# EAGLE schematic Motherboard (EAGLE 6.2)

## Sheet 1 of 5: Main Processor
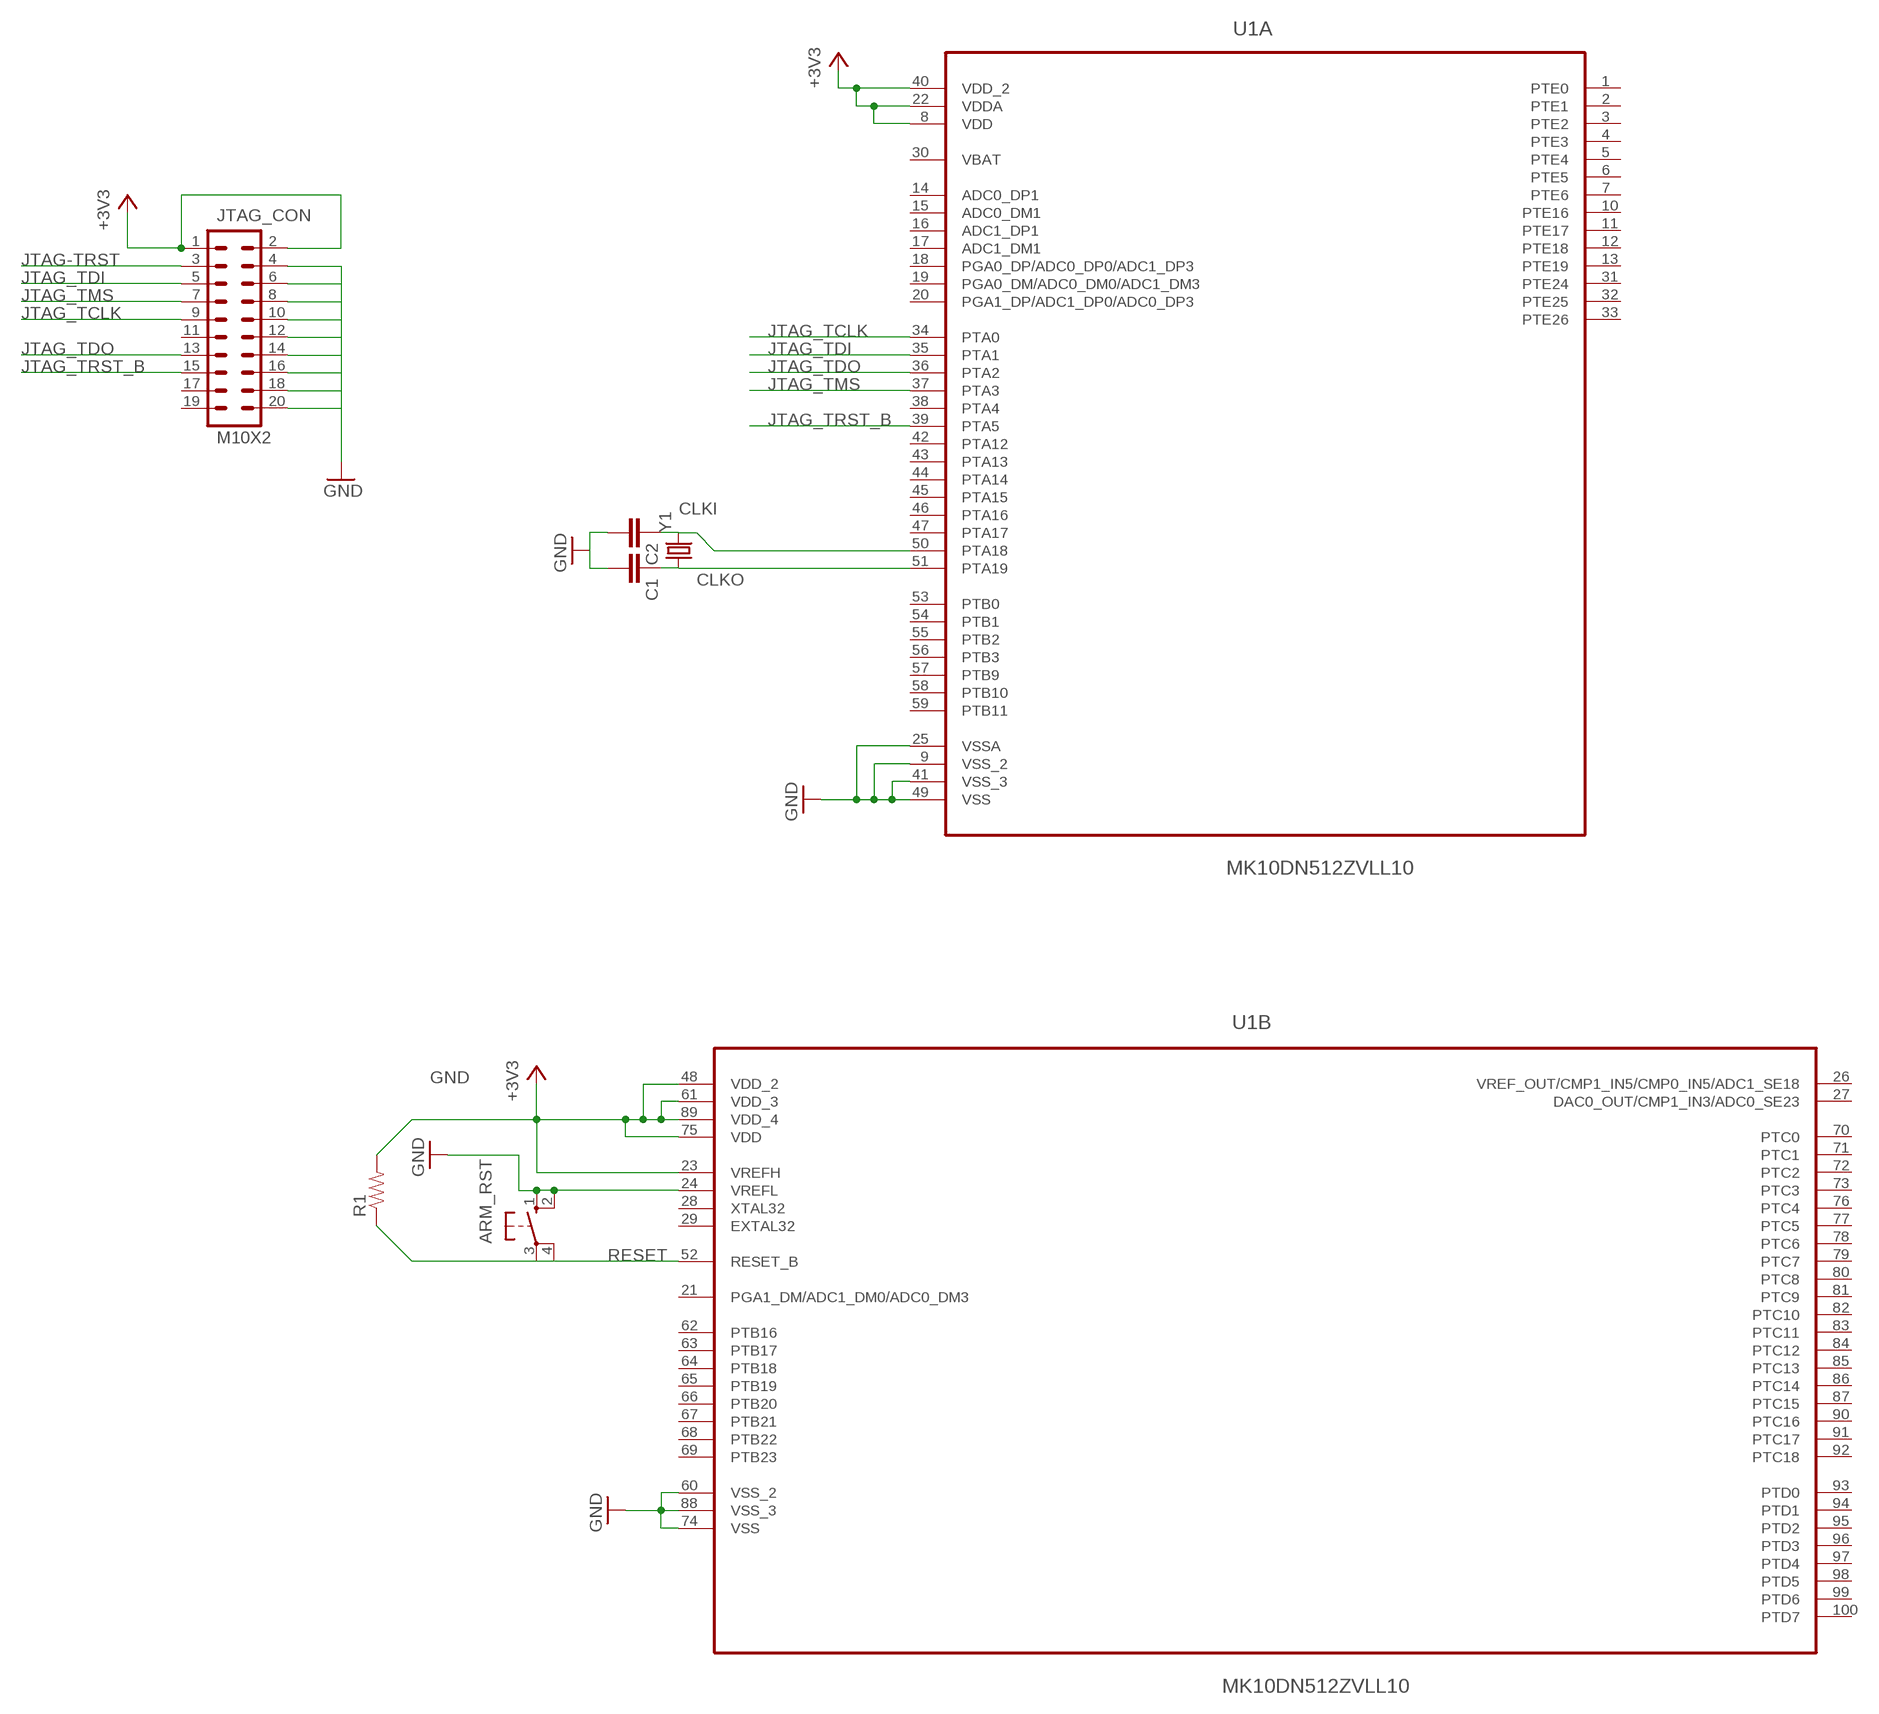
[diagram p0: schematic, sheet 1]

### Parts
ARM_RST  10-XX  [B3F-10XX]
C1  CAPPTH1  [CAP-PTH-5MM]
C2  CAPPTH1  [CAP-PTH-5MM]
JTAG_CON  M10X2  [2X10]
R1  RESISTORPTH-1/4W  [AXIAL-0.4]
U1  MK10DN512ZVLL10  [QFP50P1600X1600X170-100N]
Y1  CRYSTALHC49US  [HC49US]

### Nets
+3V3: JTAG_CON.1 JTAG_CON.2 R1.P$2 U1.8(A:VDD) U1.22(A:VDDA) U1.23(B:VREFH) U1.40(A:VDD_2) U1.48(B:VDD_2) U1.61(B:VDD_3) U1.75(B:VDD) U1.89(B:VDD_4)
CLKI: C2.1 U1.50(A:PTA18) Y1.2
CLKO: C1.1 U1.51(A:PTA19) Y1.1
GND: ARM_RST.1(S) ARM_RST.2(S1) C1.2 C2.2 JTAG_CON.4 JTAG_CON.6 JTAG_CON.8 JTAG_CON.10 JTAG_CON.12 JTAG_CON.14 JTAG_CON.16 JTAG_CON.18 JTAG_CON.20 U1.9(A:VSS_2) U1.24(B:VREFL) U1.25(A:VSSA) U1.41(A:VSS_3) U1.49(A:VSS) U1.60(B:VSS_2) U1.74(B:VSS) U1.88(B:VSS_3) ; also sheet 2,4
JTAG-TRST: JTAG_CON.3
JTAG_TCLK: JTAG_CON.9 U1.34(A:PTA0)
JTAG_TDI: JTAG_CON.5 U1.35(A:PTA1)
JTAG_TDO: JTAG_CON.13 U1.36(A:PTA2)
JTAG_TMS: JTAG_CON.7 U1.37(A:PTA3)
JTAG_TRST_B: JTAG_CON.15 U1.39(A:PTA5)
RESET: ARM_RST.3(P) ARM_RST.4(P1) R1.P$1 U1.52(B:RESET_B)
Unconnected: JTAG_CON.11 JTAG_CON.17 JTAG_CON.19 U1.1(A:PTE0) U1.2(A:PTE1) U1.3(A:PTE2) U1.4(A:PTE3) U1.5(A:PTE4) U1.6(A:PTE5) U1.7(A:PTE6) U1.10(A:PTE16) U1.11(A:PTE17) U1.12(A:PTE18) U1.13(A:PTE19) U1.14(A:ADC0_DP1) U1.15(A:ADC0_DM1) U1.16(A:ADC1_DP1) U1.17(A:ADC1_DM1) U1.18(A:PGA0_DP/ADC0_DP0/ADC1_DP3) U1.19(A:PGA0_DM/ADC0_DM0/ADC1_DM3) U1.20(A:PGA1_DP/ADC1_DP0/ADC0_DP3) U1.21(B:PGA1_DM/ADC1_DM0/ADC0_DM3) U1.26(B:VREF_OUT/CMP1_IN5/CMP0_IN5/ADC1_SE18) U1.27(B:DAC0_OUT/CMP1_IN3/ADC0_SE23) U1.28(B:XTAL32) U1.29(B:EXTAL32) U1.31(A:PTE24) U1.32(A:PTE25) U1.33(A:PTE26) U1.38(A:PTA4) U1.42(A:PTA12) U1.43(A:PTA13) U1.44(A:PTA14) U1.45(A:PTA15) U1.46(A:PTA16) U1.47(A:PTA17) U1.53(A:PTB0) U1.54(A:PTB1) U1.55(A:PTB2) U1.56(A:PTB3) U1.57(A:PTB9) U1.58(A:PTB10) U1.59(A:PTB11) U1.62(B:PTB16) U1.63(B:PTB17) U1.64(B:PTB18) U1.65(B:PTB19) U1.66(B:PTB20) U1.67(B:PTB21) U1.68(B:PTB22) U1.69(B:PTB23) U1.70(B:PTC0) U1.71(B:PTC1) U1.72(B:PTC2) U1.73(B:PTC3) U1.76(B:PTC4) U1.77(B:PTC5) U1.78(B:PTC6) U1.79(B:PTC7) U1.80(B:PTC8) U1.81(B:PTC9) U1.82(B:PTC10) U1.83(B:PTC11) U1.84(B:PTC12) U1.85(B:PTC13) U1.86(B:PTC14) U1.87(B:PTC15) U1.90(B:PTC16) U1.91(B:PTC17) U1.92(B:PTC18) U1.93(B:PTD0) U1.94(B:PTD1) U1.95(B:PTD2) U1.96(B:PTD3) U1.97(B:PTD4) U1.98(B:PTD5) U1.99(B:PTD6) U1.100(B:PTD7)

## Sheet 2 of 5: RS-485 External
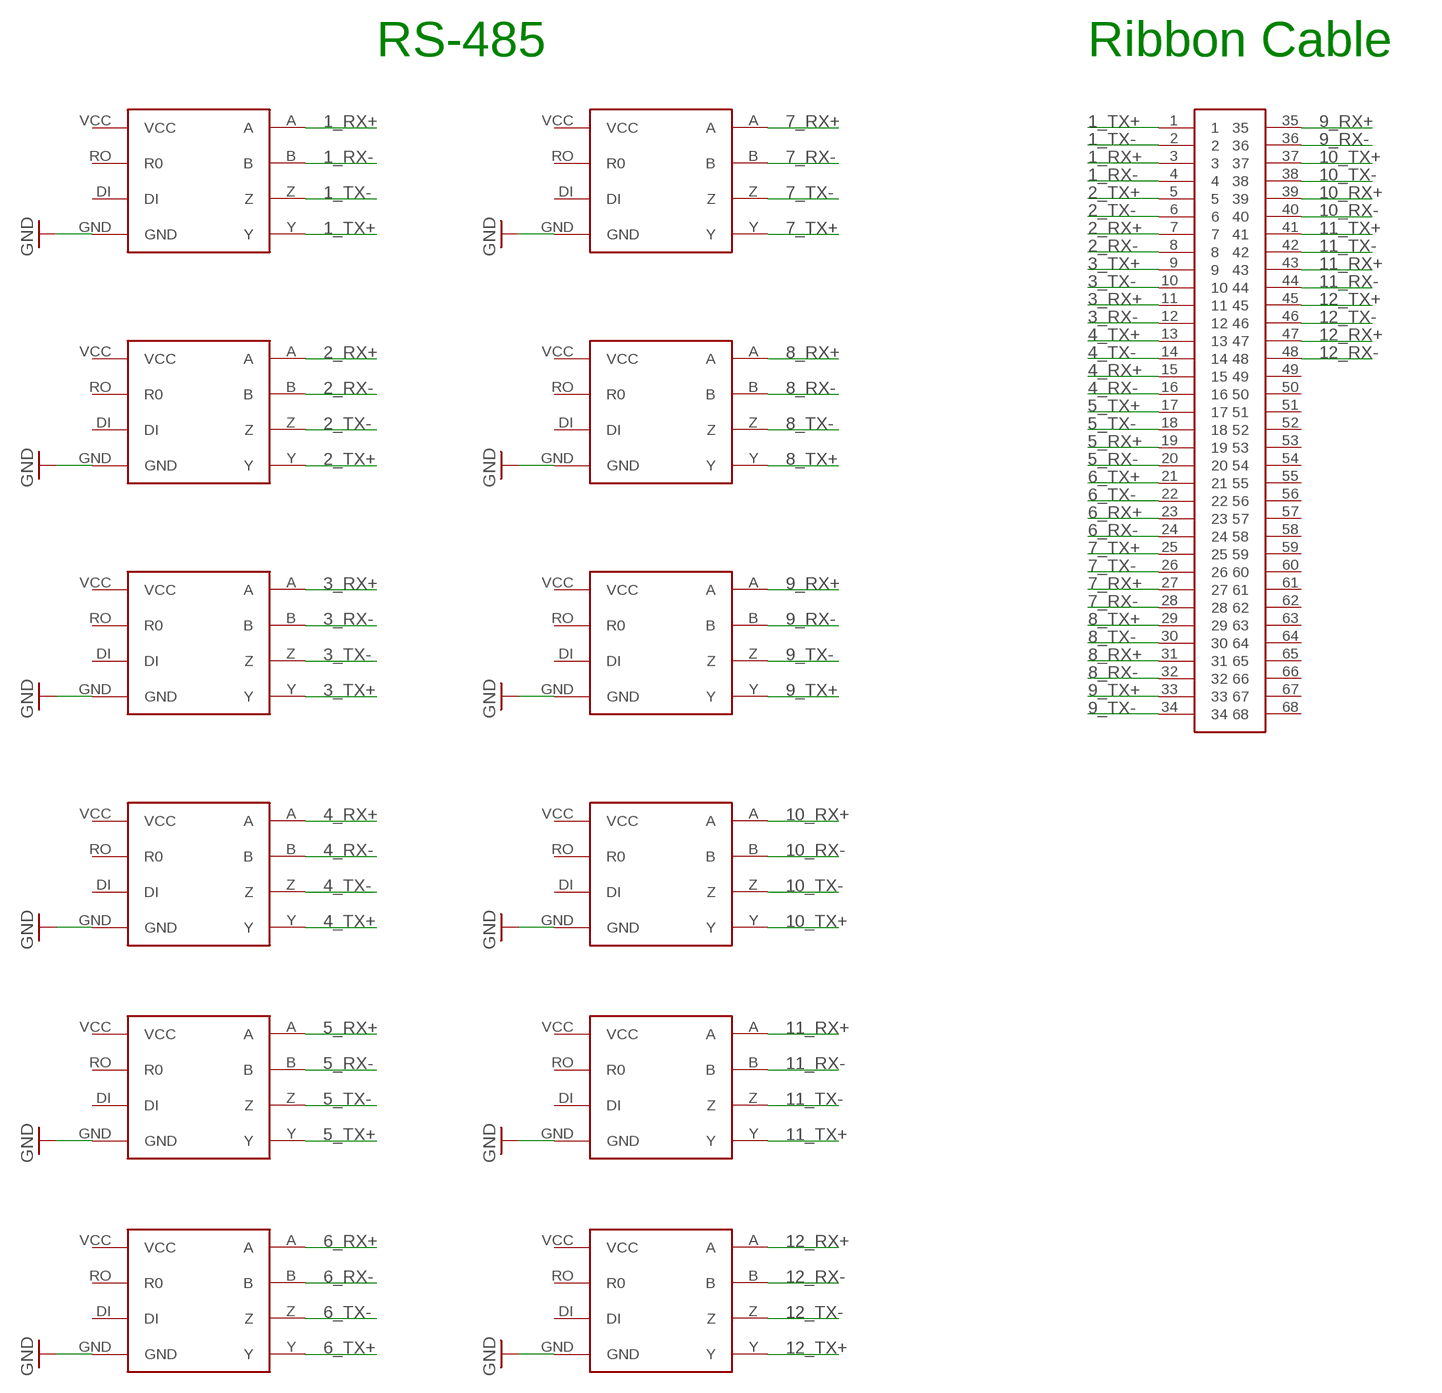
[diagram p1: schematic, sheet 2]

### Parts
U$4  MAX3077  [MAX3070E]
U$25  MAX3077  [MAX3070E]
U$26  MAX3077  [MAX3070E]
U$27  MAX3077  [MAX3070E]
U$28  MAX3077  [MAX3070E]
U$29  MAX3077  [MAX3070E]
U$30  MAX3077  [MAX3070E]
U$31  MAX3077  [MAX3070E]
U$32  MAX3077  [MAX3070E]
U$33  MAX3077  [MAX3070E]
U$34  MAX3077  [MAX3070E]
U$35  MAX3077  [MAX3070E]
U$36  TB60050685100  [60050685100]

### Nets
1_RX+: U$29.A U$36.3
1_RX-: U$29.B U$36.4
1_TX+: U$29.Y U$36.1
1_TX-: U$29.Z U$36.2
2_RX+: U$31.A U$36.7
2_RX-: U$31.B U$36.8
2_TX+: U$31.Y U$36.5
2_TX-: U$31.Z U$36.6
3_RX+: U$32.A U$36.11
3_RX-: U$32.B U$36.12
3_TX+: U$32.Y U$36.9
3_TX-: U$32.Z U$36.10
4_RX+: U$33.A U$36.15
4_RX-: U$33.B U$36.16
4_TX+: U$33.Y U$36.13
4_TX-: U$33.Z U$36.14
5_RX+: U$34.A U$36.19
5_RX-: U$34.B U$36.20
5_TX+: U$34.Y U$36.17
5_TX-: U$34.Z U$36.18
6_RX+: U$35.A U$36.23
6_RX-: U$35.B U$36.24
6_TX+: U$35.Y U$36.21
6_TX-: U$35.Z U$36.22
7_RX+: U$30.A U$36.27
7_RX-: U$30.B U$36.28
7_TX+: U$30.Y U$36.25
7_TX-: U$30.Z U$36.26
8_RX+: U$28.A U$36.31
8_RX-: U$28.B U$36.32
8_TX+: U$28.Y U$36.29
8_TX-: U$28.Z U$36.30
9_RX+: U$27.A U$36.35
9_RX-: U$27.B U$36.36
9_TX+: U$27.Y U$36.33
9_TX-: U$27.Z U$36.34
10_RX+: U$26.A U$36.39
10_RX-: U$26.B U$36.40
10_TX+: U$26.Y U$36.37
10_TX-: U$26.Z U$36.38
11_RX+: U$25.A U$36.43
11_RX-: U$25.B U$36.44
11_TX+: U$25.Y U$36.41
11_TX-: U$25.Z U$36.42
12_RX+: U$4.A U$36.47
12_RX-: U$4.B U$36.48
12_TX+: U$4.Y U$36.45
12_TX-: U$4.Z U$36.46
GND: U$4.GND U$25.GND U$26.GND U$27.GND U$28.GND U$29.GND U$30.GND U$31.GND U$32.GND U$33.GND U$34.GND U$35.GND ; also sheet 1,4
Unconnected: U$4.DI U$4.RO(R0) U$4.VCC U$25.DI U$25.RO(R0) U$25.VCC U$26.DI U$26.RO(R0) U$26.VCC U$27.DI U$27.RO(R0) U$27.VCC U$28.DI U$28.RO(R0) U$28.VCC U$29.DI U$29.RO(R0) U$29.VCC U$30.DI U$30.RO(R0) U$30.VCC U$31.DI U$31.RO(R0) U$31.VCC U$32.DI U$32.RO(R0) U$32.VCC U$33.DI U$33.RO(R0) U$33.VCC U$34.DI U$34.RO(R0) U$34.VCC U$35.DI U$35.RO(R0) U$35.VCC U$36.49 U$36.50 U$36.51 U$36.52 U$36.53 U$36.54 U$36.55 U$36.56 U$36.57 U$36.58 U$36.59 U$36.60 U$36.61 U$36.62 U$36.63 U$36.64 U$36.65 U$36.66 U$36.67 U$36.68

### Notes on the sheet
- RS-485 | Ribbon Cable

## Sheet 3 of 5: RS-485 Internal
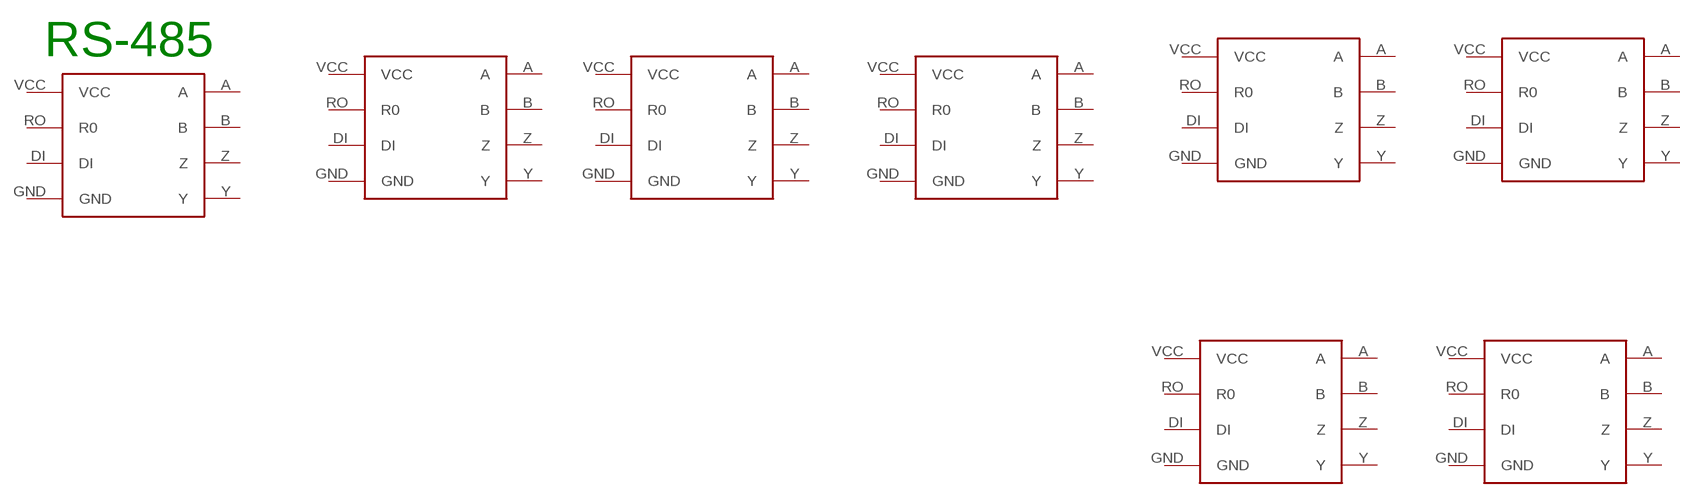
[diagram p2: schematic, sheet 3]

### Parts
U$3  MAX3077  [MAX3070E]
U$5  MAX3077  [MAX3070E]
U$6  MAX3077  [MAX3070E]
U$7  MAX3077  [MAX3070E]
U$8  MAX3077  [MAX3070E]
U$9  MAX3077  [MAX3070E]
U$10  MAX3077  [MAX3070E]
U$11  MAX3077  [MAX3070E]
Unconnected: U$3.A U$3.B U$3.DI U$3.GND U$3.RO(R0) U$3.VCC U$3.Y U$3.Z U$5.A U$5.B U$5.DI U$5.GND U$5.RO(R0) U$5.VCC U$5.Y U$5.Z U$6.A U$6.B U$6.DI U$6.GND U$6.RO(R0) U$6.VCC U$6.Y U$6.Z U$7.A U$7.B U$7.DI U$7.GND U$7.RO(R0) U$7.VCC U$7.Y U$7.Z U$8.A U$8.B U$8.DI U$8.GND U$8.RO(R0) U$8.VCC U$8.Y U$8.Z U$9.A U$9.B U$9.DI U$9.GND U$9.RO(R0) U$9.VCC U$9.Y U$9.Z U$10.A U$10.B U$10.DI U$10.GND U$10.RO(R0) U$10.VCC U$10.Y U$10.Z U$11.A U$11.B U$11.DI U$11.GND U$11.RO(R0) U$11.VCC U$11.Y U$11.Z

### Notes on the sheet
- RS-485

## Sheet 4 of 5: Sensors
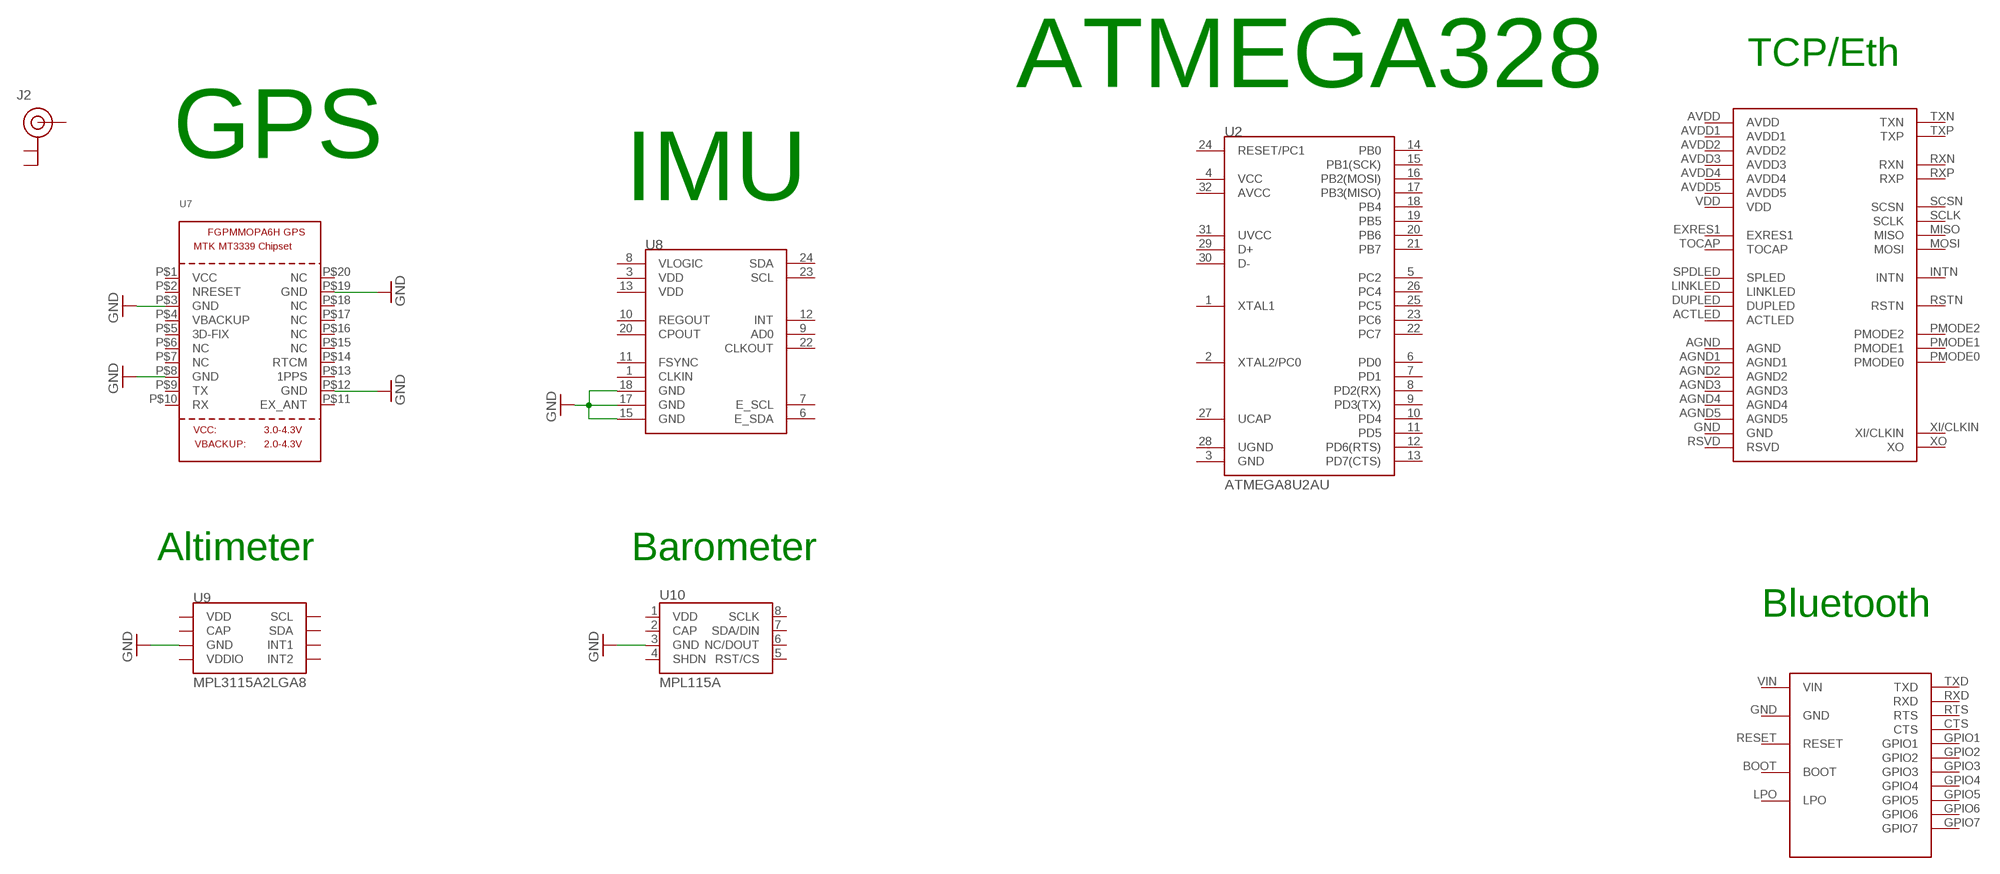
[diagram p3: schematic, sheet 4]

### Parts
J2  U.FL  [U.FL]
U2  ATMEGA8U2AU  [TQFP32-08]
U7  GPS_FGPMMOPA6H  [FGPMMOPA6H]
U8  MPU-9150QFN-24-NP  [QFN-24-NP]
U9  MPL3115A2LGA8  [LGA8]
U10  MPL115A  [LGA8]
U$12  W5500  [W5500]
U$13  SPBT2632C2A  [SPBT2632C2A]

### Nets
GND: U7.P$3(GND) U7.P$8(GND) U7.P$12(GND) U7.P$19(GND) U8.15(GND) U8.17(GND) U8.18(GND) U9.3(GND) U10.3(GND) ; also sheet 1,2
Unconnected: J2.P$1(GND) J2.P$2(GND) J2.P$3(SIGNAL) U2.1(XTAL1) U2.2(XTAL2/PC0) U2.3(GND) U2.4(VCC) U2.5(PC2) U2.6(PD0) U2.7(PD1) U2.8(PD2(RX)) U2.9(PD3(TX)) U2.10(PD4) U2.11(PD5) U2.12(PD6(RTS)) U2.13(PD7(CTS)) U2.14(PB0) U2.15(PB1(SCK)) U2.16(PB2(MOSI)) U2.17(PB3(MISO)) U2.18(PB4) U2.19(PB5) U2.20(PB6) U2.21(PB7) U2.22(PC7) U2.23(PC6) U2.24(RESET/PC1) U2.25(PC5) U2.26(PC4) U2.27(UCAP) U2.28(UGND) U2.29(D+) U2.30(D-) U2.31(UVCC) U2.32(AVCC) U7.P$1(VCC) U7.P$2(NRESET) U7.P$4(VBACKUP) U7.P$5(3D-FIX) U7.P$6(NC) U7.P$7(NC) U7.P$9(TX) U7.P$10(RX) U7.P$11(EX_ANT) U7.P$13(1PPS) U7.P$14(RTCM) U7.P$15(NC) U7.P$16(NC) U7.P$17(NC) U7.P$18(NC) U7.P$20(NC) U8.1(CLKIN) U8.3(VDD) U8.6(E_SDA) U8.7(E_SCL) U8.8(VLOGIC) U8.9(AD0) U8.10(REGOUT) U8.11(FSYNC) U8.12(INT) U8.13(VDD) U8.20(CPOUT) U8.22(CLKOUT) U8.23(SCL) U8.24(SDA) U9.5(INT2) U9.6(INT1) U9.7(SDA) U9.8(SCL) U10.1(VDD) U10.2(CAP) U10.4(SHDN) U10.5(RST/CS) U10.6(NC/DOUT) U10.7(SDA/DIN) U10.8(SCLK) U$12.ACTLED U$12.AGND U$12.AGND1 U$12.AGND2 U$12.AGND3 U$12.AGND4 U$12.AGND5 U$12.AVDD U$12.AVDD1 U$12.AVDD2 U$12.AVDD3 U$12.AVDD4 U$12.AVDD5 U$12.DUPLED U$12.EXRES1 U$12.GND U$12.INTN U$12.LINKLED U$12.MISO U$12.MOSI U$12.PMODE0 U$12.PMODE1 U$12.PMODE2 U$12.RSTN U$12.RSVD U$12.RXN U$12.RXP U$12.SCLK U$12.SCSN U$12.SPDLED(SPLED) U$12.TOCAP U$12.TXN U$12.TXP U$12.VDD U$12.XI/CLKIN U$12.XO U$13.BOOT U$13.CTS U$13.GND U$13.GPIO1 U$13.GPIO2 U$13.GPIO3 U$13.GPIO4 U$13.GPIO5 U$13.GPIO6 U$13.GPIO7 U$13.LPO U$13.RESET U$13.RTS U$13.RXD U$13.TXD U$13.VIN

### Notes on the sheet
- ATMEGA328
- TCP/Eth
- GPS
- IMU
- Altimeter
- Barometer
- Bluetooth

## Sheet 5 of 5: Power

## Power pins joined to a net without a drawn wire
CAP: U9.2(CAP)
VBAT: U1.30(A:VBAT)
VDD: U9.1(VDD)
VDDIO: U9.4(VDDIO)

## Library data of the parts
ARM_RST = switch-omron:10-XX: OMRON SWITCH; MPN: B3F-1000; OC_FARNELL: 176432; OC_NEWARK: 36M3542
C1 C2 = SparkFun-Passives:CAP: Capacitor Standard 0603 ceramic capacitor, and 0.1" leaded capacitor.
J2 = SparkFun-Connectors:U.FL: SMD antenna connector- WRL-09144
JTAG_CON = SparkFun-Connectors:M10X2: This was SPECIALLY designed to be used with our Graphic LCD Backpack. Be sure you want to use this! It is not only staggered on each line of header holes, but IT IS ALSO offset of the center point of the top and bottom lines by 5 mil. This causes the headers to lock into place on the "standard" footprint on the LCD screen. The extra squares on the tdocu layer are there simply to reference other pins (if you were to actually populate a longer header than ten long - this is what we do with the backpacks).
R1 = SparkFun-Resistors:RESISTOR: Resistor Basic schematic elements and footprints for 0603, 1206, and PTH resistors.
U1 = Main_Processor:MK10DN512ZVLL10: MCU, 32 BIT, KINETIS, K10, LQFP-100; MPN: MK10DN512ZVLL10; OC_FARNELL: 2070276; OC_NEWARK: 75T7577; PACKAGE: LQFP-100; SUPPLIER: FREESCALE SEMICONDUCTOR
U2 = SparkFun-DigitalIC:ATMEGA8U2: Atmel 32-pin 8-bit Microcontroller with 8/16/32K Bystes of ISP Flash and USB Controller. ATmega8U2, ATmega16U2, and ATmega32U2
U7 = adafruit:GPS_FGPMMOPA6H: GPS Module - MTK MT3339 Chipset, -165dBm sensitivity, 22 channels, 10Hz, auto-select external antenna options
U8 = SparkFun-Sensors:MPU-9150: 9DOF (3mag, 3accel, 3rotat). I2C interface.
U9 = SparkFun-Sensors:MPL3115A2: Altimeter/Pressure Sensor, I2C, 1.95V-3.6V supply, 50 to 110kPa
U10 = SparkFun-Sensors:MPL115A: MPL115A1 (SPI) and MPL115A2 (I2C) Miniature Digital Barometer 5.0x3.0x1.2mm LGA Package
U$3-U$11 U$25-U$35 = MAX3077:MAX3077
U$12 = w5500_wiznet:W5500
U$13 = SPBT2632C2A:SPBT2632C2A
U$36 = harting-scsi:TB60050685100
Y1 = SparkFun-FreqCtrl:CRYSTAL: Various standard crystals. Proven footprints. Spark Fun Electronics SKU : COM-00534